# EAGLE design 02_SETAB (EAGLE 7.5.0)
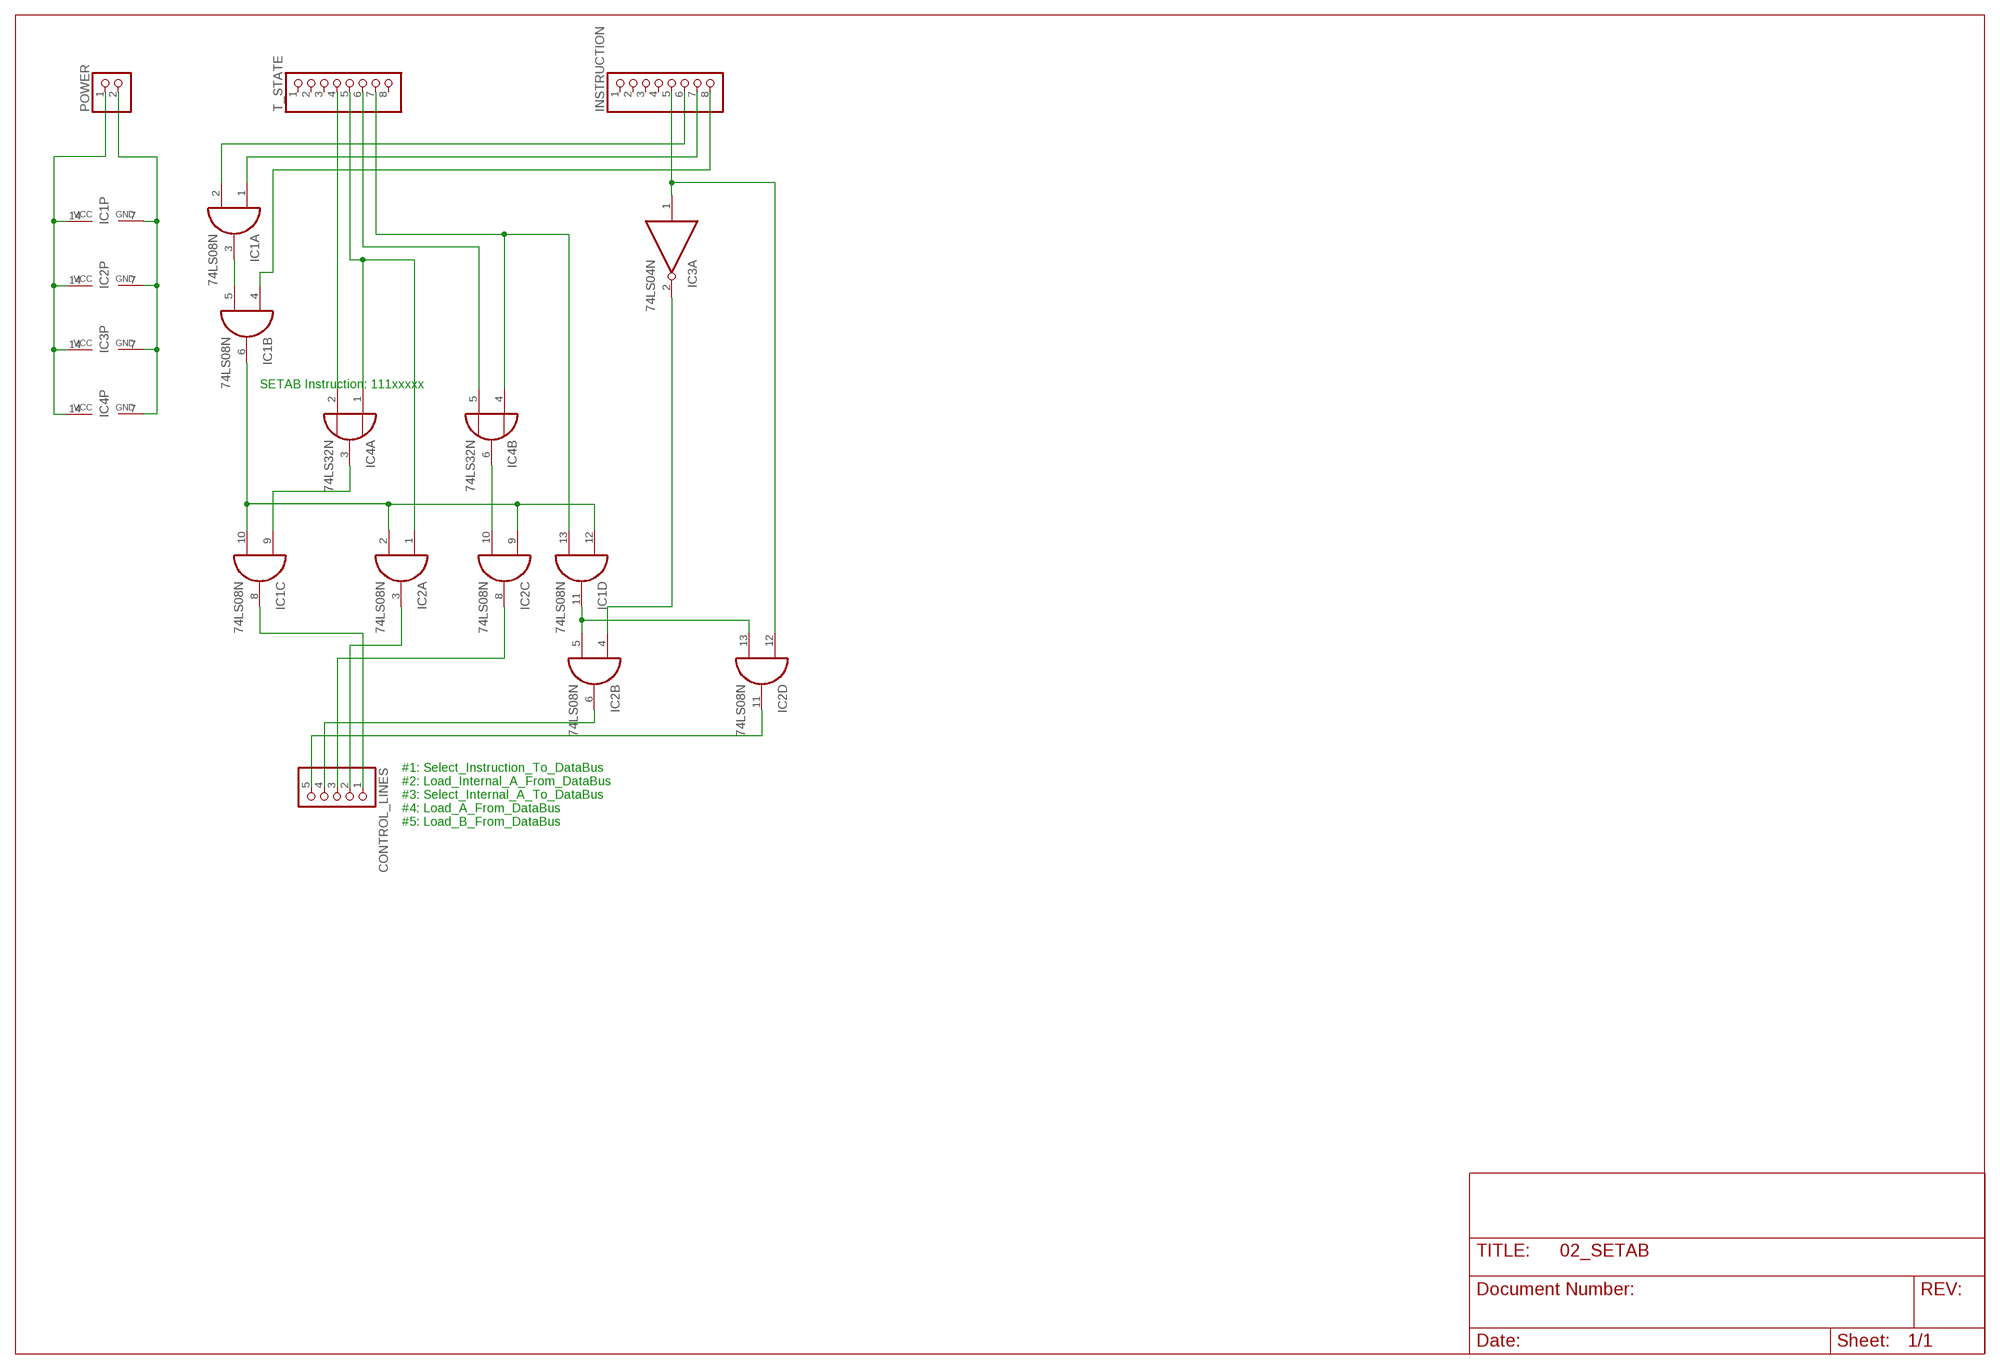
[diagram p0: schematic, sheet 1]

## Parts
CONTROL_LINES  PINHD-1X5  [1X05]
IC1  74LS08N  [DIL14]
IC2  74LS08N  [DIL14]
IC3  74LS04N  [DIL14]
IC4  74LS32N  [DIL14]
INSTRUCTION  PINHD-1X8  [1X08]
POWER  PINHD-1X2  [1X02]
T_STATE  PINHD-1X8  [1X08]

## Nets
GND: IC1.7(P:GND) IC2.7(P:GND) IC3.7(P:GND) IC4.7(P:GND) POWER.2
N$1: IC1.2(A:I1) INSTRUCTION.6
N$2: IC1.1(A:I0) INSTRUCTION.7
N$3: IC1.3(A:O) IC1.5(B:I1)
N$4: IC1.4(B:I0) INSTRUCTION.8
N$5: IC2.1(A:I0) IC4.1(A:I0) T_STATE.5
N$6: IC4.2(A:I1) T_STATE.4
N$7: CONTROL_LINES.1 IC1.8(C:O)
N$8: IC1.6(B:O) IC1.10(C:I1) IC1.12(D:I0) IC2.2(A:I1) IC2.9(C:I0)
N$9: IC1.9(C:I0) IC4.3(A:O)
N$10: CONTROL_LINES.4 IC2.6(B:O)
N$11: IC2.12(D:I0) IC3.1(A:I) INSTRUCTION.5
N$12: IC2.4(B:I0) IC3.2(A:O)
N$13: CONTROL_LINES.2 IC2.3(A:O)
N$14: IC4.5(B:I1) T_STATE.6
N$15: IC1.13(D:I1) IC4.4(B:I0) T_STATE.7
N$16: IC2.10(C:I1) IC4.6(B:O)
N$17: CONTROL_LINES.3 IC2.8(C:O)
N$18: IC1.11(D:O) IC2.5(B:I1) IC2.13(D:I1)
N$20: CONTROL_LINES.5 IC2.11(D:O)
VCC: IC1.14(P:VCC) IC2.14(P:VCC) IC3.14(P:VCC) IC4.14(P:VCC) POWER.1
Unconnected: IC3.3(B:I) IC3.4(B:O) IC3.5(C:I) IC3.6(C:O) IC3.8(D:O) IC3.9(D:I) IC3.10(E:O) IC3.11(E:I) IC3.12(F:O) IC3.13(F:I) IC4.8(C:O) IC4.9(C:I0) IC4.10(C:I1) IC4.11(D:O) IC4.12(D:I0) IC4.13(D:I1) INSTRUCTION.1 INSTRUCTION.2 INSTRUCTION.3 INSTRUCTION.4 T_STATE.1 T_STATE.2 T_STATE.3 T_STATE.8

## Notes on the sheet
- SETAB Instruction: 111xxxxx
- #1: Select_Instruction_To_DataBus
  #2: Load_Internal_A_From_DataBus
  #3: Select_Internal_A_To_DataBus
  #4: Load_A_From_DataBus
  #5: Load_B_From_DataBus

## Library data of the parts
CONTROL_LINES = pinhead:PINHD-1X5: PIN HEADER
IC1 IC2 = 74xx-eu:74*08: Quad 2-input AND gate
IC3 = 74xx-eu:74*04: Hex INVERTER
IC4 = 74xx-eu:74*32: Quad 2-input OR gate
INSTRUCTION T_STATE = pinhead:PINHD-1X8: PIN HEADER
POWER = pinhead:PINHD-1X2: PIN HEADER

## Board
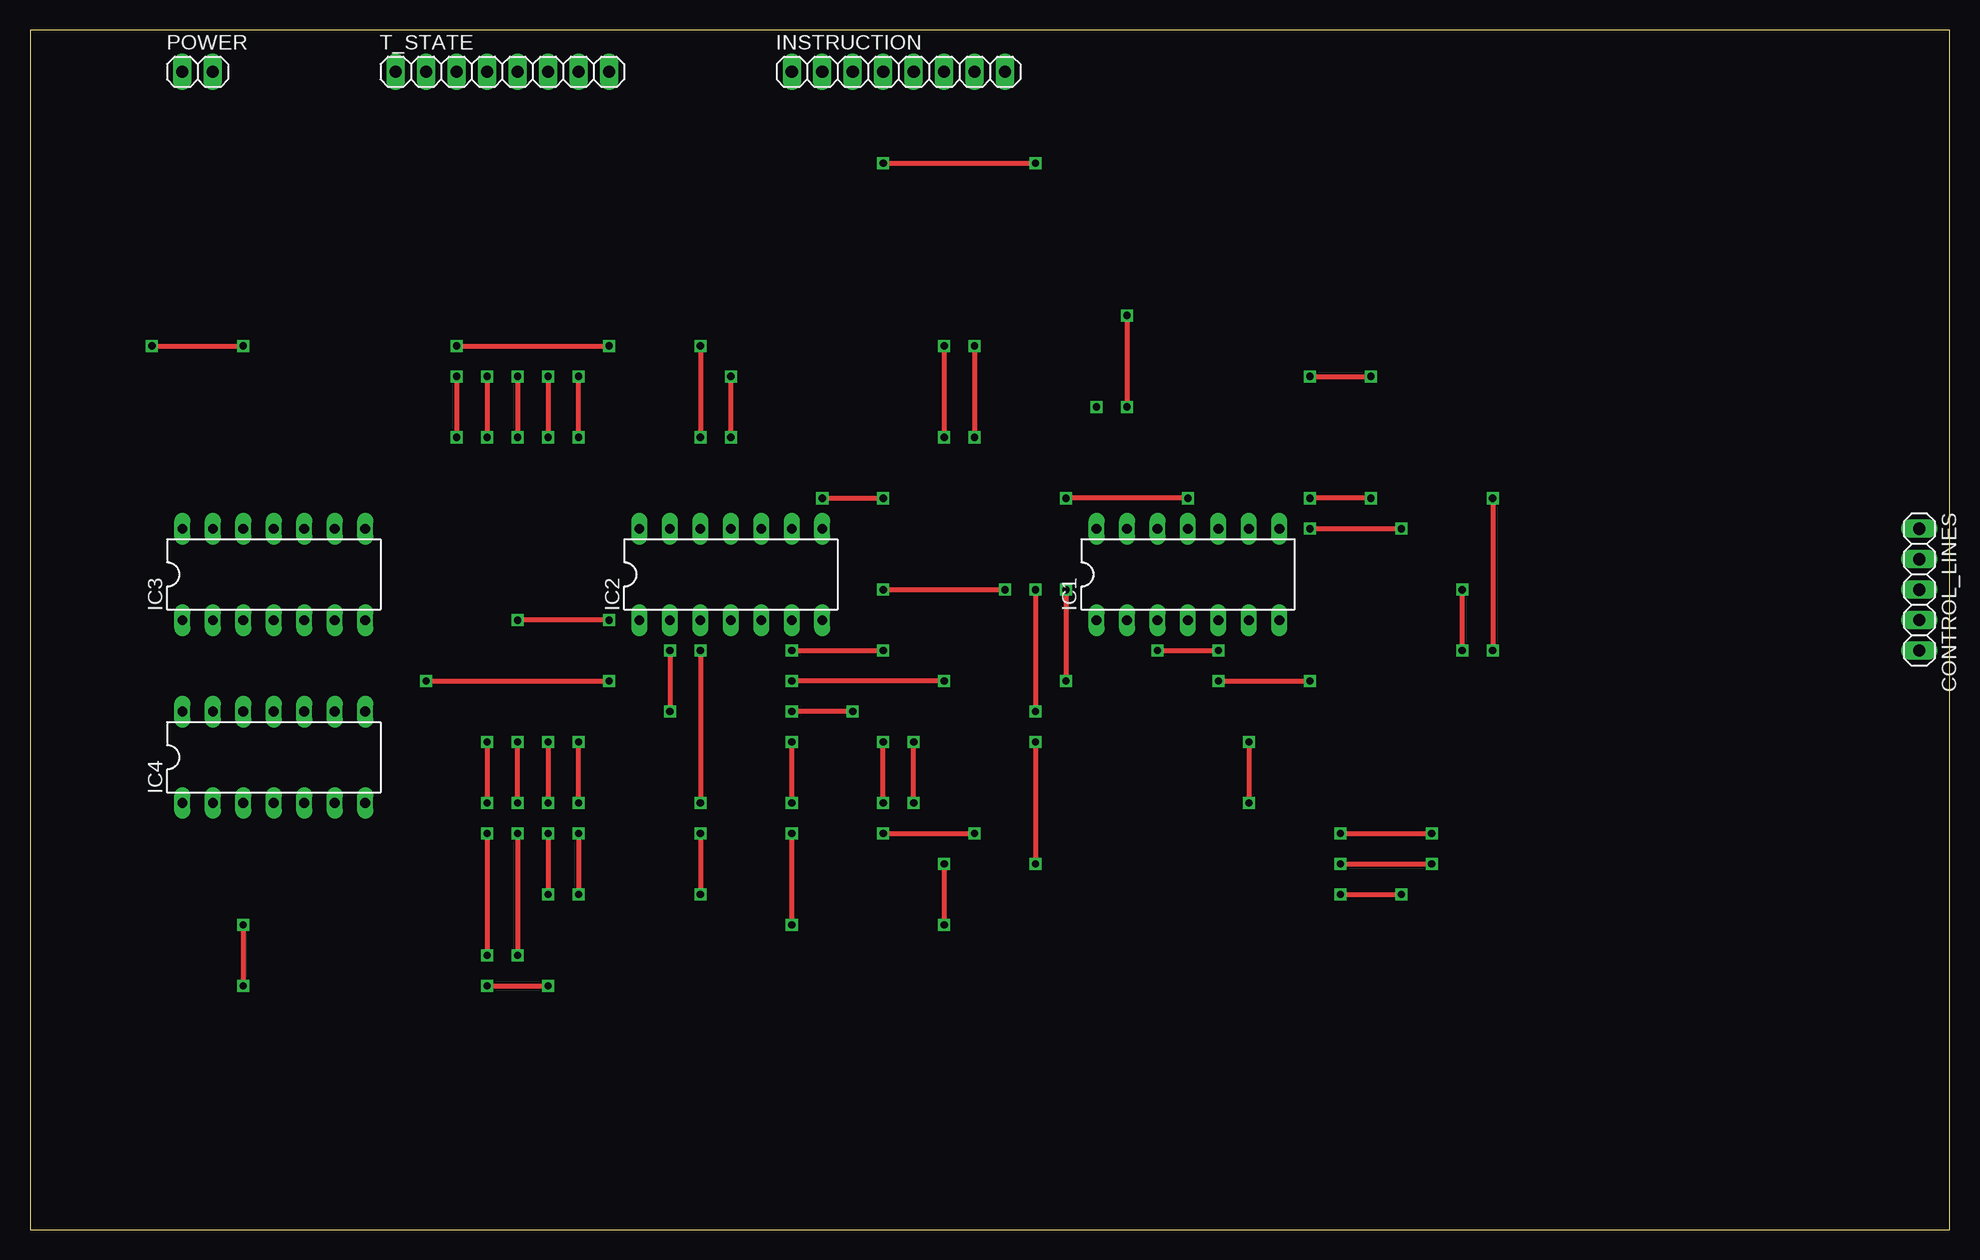
[diagram p1: board, top side]
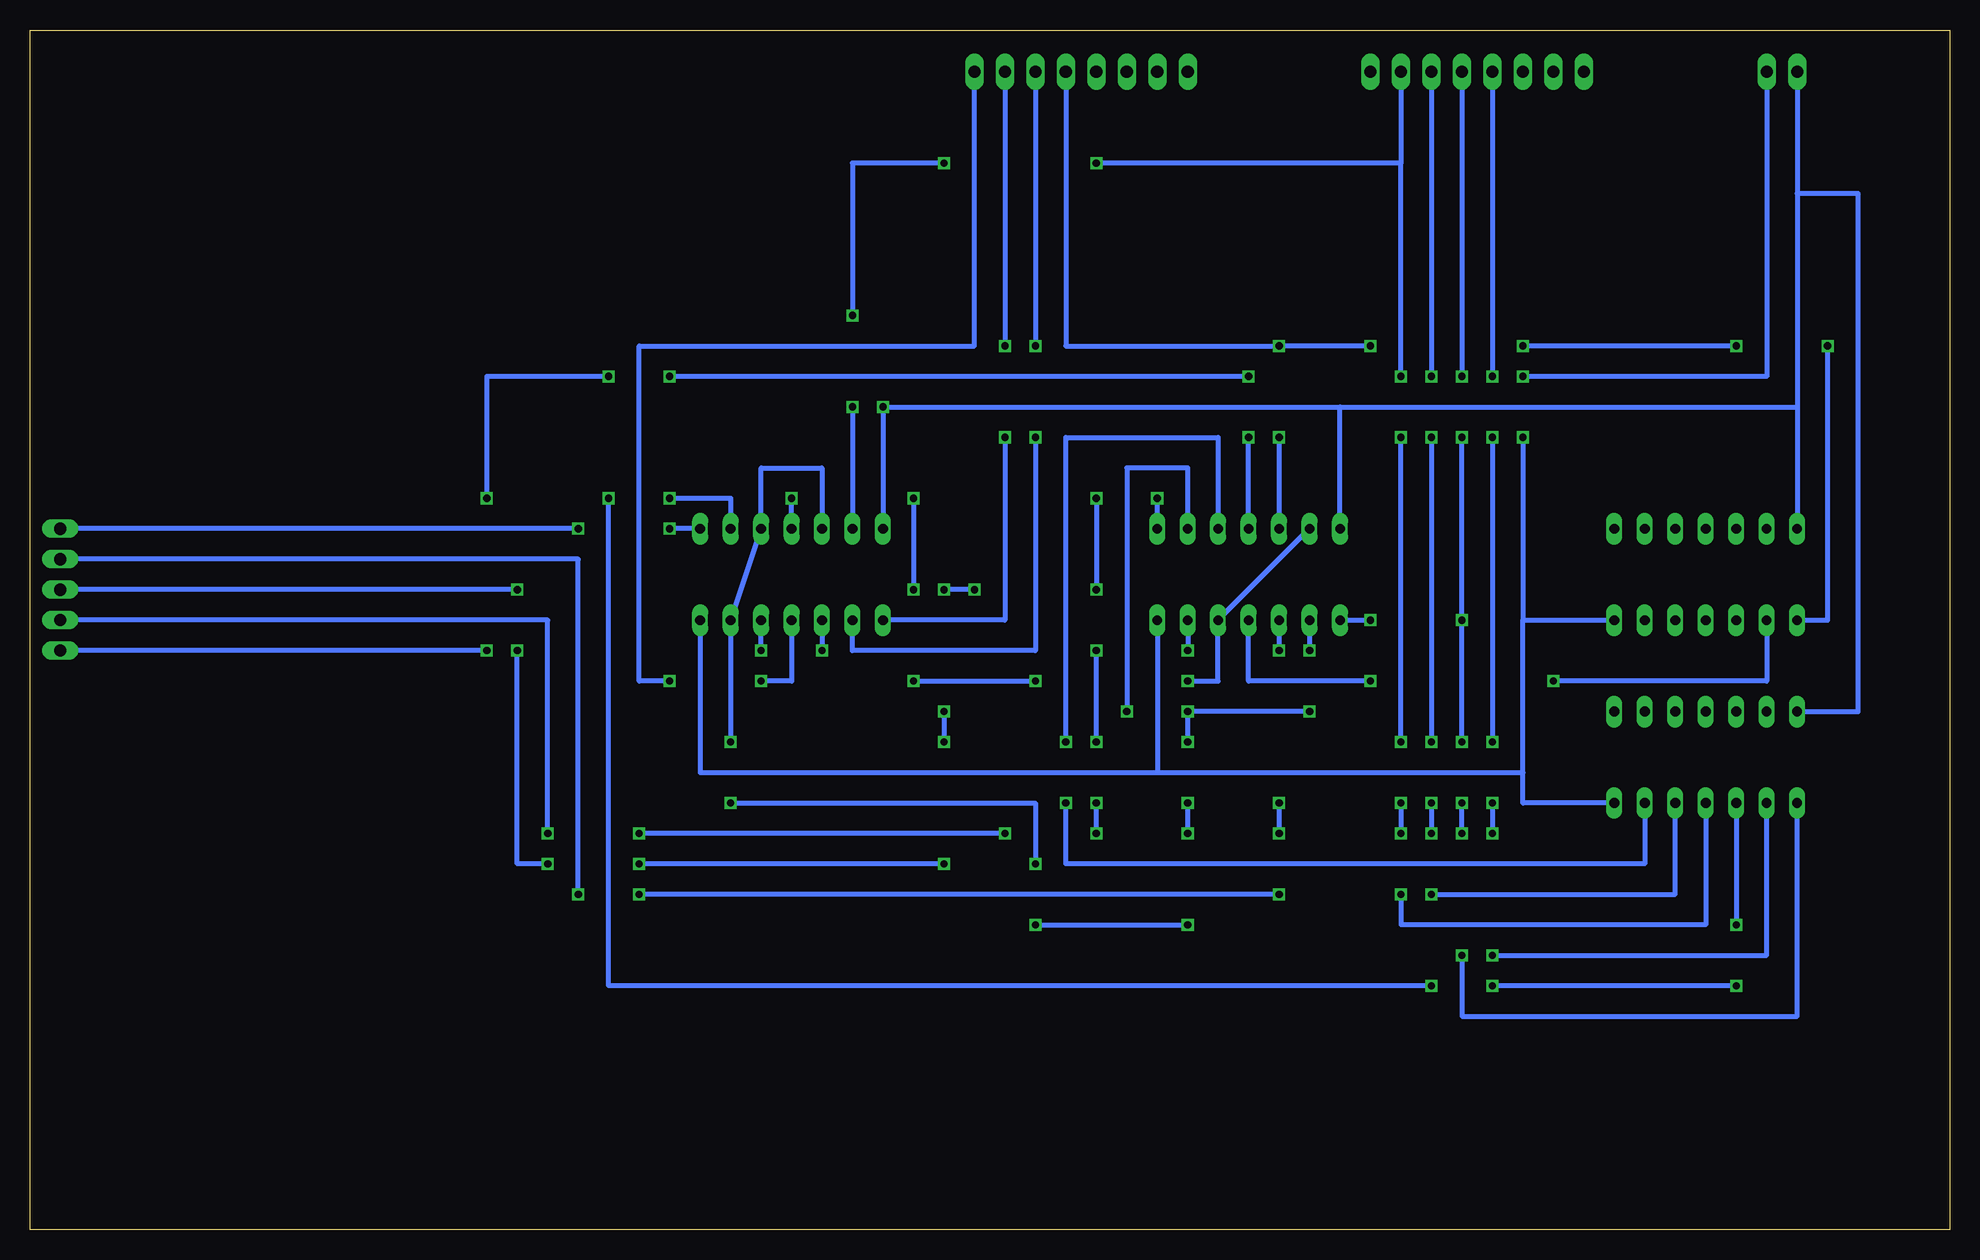
[diagram p2: board, bottom side, seen from below]

Size 160 x 100 mm. Coordinates in mm from the lower left corner, seen from the top.
Outline: 0,0 160,0 160,100 0,100 0,0
Copper layers (1*16): Top 0.035mm / dielectric 1.5mm / Bottom 0.035mm
Design rules "default": minimum track width 10mil, minimum drill 24mil, track to track 8mil, track to pad 8mil, pad to pad 8mil, via to via 8mil, smd to smd 8mil, copper to edge 40mil, drill to drill 8mil, minimum pad ring 10mil, minimum via ring 8mil, stop-mask expansion 4mil, vias tented up to drill 0mil, thermal gap 10mil

### Footprints (pad centres in the part's own frame; a part is rotated, then mirrored left to right if it is on the bottom)
1X05 = drill 1.016 long: 1 -5.08,0; 2 -2.54,0; 3 0,0; 4 2.54,0; 5 5.08,0
DIL14 = drill 0.813 long: 1 -7.62,-3.81; 2 -5.08,-3.81; 3 -2.54,-3.81; 4 0,-3.81; 5 2.54,-3.81; 6 5.08,-3.81; 7 7.62,-3.81; 8 7.62,3.81; 9 5.08,3.81; 10 2.54,3.81; 11 0,3.81; 12 -2.54,3.81; 13 -5.08,3.81; 14 -7.62,3.81
1X08 = drill 1.016 long: 1 -8.89,0; 2 -6.35,0; 3 -3.81,0; 4 -1.27,0; 5 1.27,0; 6 3.81,0; 7 6.35,0; 8 8.89,0
1X02 = drill 1.016 long: 1 -1.27,0; 2 1.27,0

### Placement (x,y rotation side)
CONTROL_LINES  157.48,53.34 270 top
IC1  96.52,54.61 0 top
IC2  58.42,54.61 0 top
IC3  20.32,54.61 0 top
IC4  20.32,39.37 0 top
INSTRUCTION  72.39,96.52 0 top
POWER  13.97,96.52 0 top
T_STATE  39.37,96.52 0 top

### Tracks (layer width: path | path; a pad name or v marks a point on that pad's centre or on a via)
GND  (via drill 0.6)
  Top 0.406: v35.56,71.12 v35.56,66.04
  Bottom 0.406: POWER.2 15.24,71.12 v35.56,71.12 | v35.56,66.04 35.56,50.8 | 35.56,50.8 IC3.7 | IC2.7 66.04,38.1 | 66.04,38.1 35.56,38.1 | 35.56,38.1 35.56,50.8 | IC1.7 104.14,38.1 66.04,38.1 | IC4.7 35.56,35.56 35.56,38.1
N$1  (via drill 0.6)
  Top 0.406: v76.2,73.66 v76.2,66.04
  Bottom 0.406: INSTRUCTION.6 v76.2,73.66 | v76.2,66.04 76.2,48.26 91.44,48.26 IC1.2
N$2  (via drill 0.6)
  Top 0.406: v78.74,73.66 v78.74,66.04
  Bottom 0.406: INSTRUCTION.7 v78.74,73.66 | v78.74,66.04 78.74,50.8 IC1.1
N$3  (via drill 0.6)
  Top 0.406: v93.98,48.26 v99.06,48.26
  Bottom 0.406: IC1.3 v93.98,48.26 | v99.06,48.26 IC1.5
N$4  (via drill 0.6)
  Top 0.406: v99.06,45.72 v106.68,45.72
  Bottom 0.406: IC1.4 96.52,45.72 v99.06,45.72 | v106.68,45.72 109.22,45.72 109.22,73.66 81.28,73.66 INSTRUCTION.8
N$5  (via drill 0.6)
  Top 0.406: v40.64,71.12 v40.64,66.04 | v40.64,33.02 v40.64,22.86 | v40.64,35.56 v40.64,40.64 | v48.26,50.8 v40.64,50.8
  Bottom 0.406: T_STATE.5 v40.64,71.12 | v40.64,22.86 40.64,17.78 12.7,17.78 IC4.1 | v40.64,33.02 v40.64,35.56 | v40.64,40.64 v40.64,50.8 v40.64,66.04 | IC2.1 v48.26,50.8
N$6  (via drill 0.6)
  Top 0.406: v38.1,71.12 v38.1,66.04 | v38.1,40.64 v38.1,35.56 | v38.1,33.02 v38.1,22.86
  Bottom 0.406: T_STATE.4 v38.1,71.12 | v38.1,66.04 v38.1,40.64 | v38.1,35.56 v38.1,33.02 | v38.1,22.86 15.24,22.86 IC4.2
N$7  (via drill 0.6)
  Top 0.406: v106.68,58.42 v114.3,58.42
  Bottom 0.406: IC1.8 v106.68,58.42 | v114.3,58.42 CONTROL_LINES.1
N$8  (via drill 0.6)
  Top 0.406: v53.34,48.26 v53.34,43.18 | v101.6,40.64 v101.6,35.56 | v76.2,30.48 v76.2,25.4 | v63.5,25.4 v63.5,33.02 | v63.5,35.56 v63.5,40.64 | v68.58,43.18 v63.5,43.18
  Bottom 0.406: IC2.2 v53.34,48.26 | v53.34,43.18 v63.5,43.18 v63.5,40.64 | IC1.12 93.98,63.5 99.06,63.5 IC1.10 IC1.6 v101.6,40.64 | v101.6,35.56 76.2,35.56 v76.2,30.48 | v76.2,25.4 v63.5,25.4 | v63.5,33.02 v63.5,35.56 | IC2.9 63.5,63.5 68.58,63.5 v68.58,43.18
N$9  (via drill 0.6)
  Top 0.406: v17.78,25.4 v17.78,20.32 | v38.1,20.32 v43.18,20.32 | v111.76,60.96 v106.68,60.96
  Bottom 0.406: IC4.3 v17.78,25.4 | v17.78,20.32 v38.1,20.32 | v43.18,20.32 111.76,20.32 v111.76,60.96 | v106.68,60.96 101.6,60.96 IC1.9
N$10  (via drill 0.6)
  Top 0.406: v63.5,48.26 v71.12,48.26 | v71.12,33.02 v78.74,33.02 | v109.22,33.02 v116.84,33.02 | v71.12,35.56 v71.12,40.64
  Bottom 0.406: IC2.6 v63.5,48.26 | v78.74,33.02 v109.22,33.02 | v116.84,33.02 116.84,50.8 CONTROL_LINES.4 | v71.12,33.02 v71.12,35.56 | v71.12,40.64 v71.12,48.26
N$11  (via drill 0.6)
  Top 0.406: v55.88,73.66 v55.88,66.04 | v10.16,73.66 v17.78,73.66 | v35.56,73.66 v48.26,73.66
  Bottom 0.406: INSTRUCTION.5 73.66,73.66 v55.88,73.66 v48.26,73.66 | IC3.1 10.16,50.8 v10.16,73.66 | v17.78,73.66 v35.56,73.66 | v55.88,66.04 IC2.12
N$12  (via drill 0.6)
  Top 0.406: v33.02,45.72 v48.26,45.72
  Bottom 0.406: IC3.2 15.24,45.72 v33.02,45.72 | v48.26,45.72 58.42,45.72 IC2.4
N$13  (via drill 0.6)
  Top 0.406: v55.88,48.26 v55.88,35.56 | v55.88,33.02 v55.88,27.94 | v109.22,27.94 v114.3,27.94
  Bottom 0.406: IC2.3 v55.88,48.26 | v55.88,35.56 v55.88,33.02 | v55.88,27.94 v109.22,27.94 | v114.3,27.94 114.3,55.88 CONTROL_LINES.2
N$14  (via drill 0.6)
  Top 0.406: v43.18,71.12 v43.18,66.04 | v43.18,40.64 v43.18,35.56 | v43.18,33.02 v43.18,27.94
  Bottom 0.406: T_STATE.6 v43.18,71.12 | v43.18,66.04 v43.18,40.64 | v43.18,27.94 22.86,27.94 IC4.5 | v43.18,35.56 v43.18,33.02
N$15  (via drill 0.6)
  Top 0.406: v71.12,88.9 v83.82,88.9 | v91.44,76.2 v91.44,68.58 | v45.72,35.56 v45.72,40.64 | v45.72,66.04 v45.72,71.12 | v45.72,33.02 v45.72,27.94
  Bottom 0.406: T_STATE.7 45.72,88.9 | 45.72,88.9 v71.12,88.9 | v83.82,88.9 91.44,88.9 v91.44,76.2 | v91.44,68.58 IC1.13 | IC4.4 20.32,25.4 45.72,25.4 v45.72,27.94 | v45.72,40.64 v45.72,66.04 | v45.72,71.12 45.72,88.9 | v45.72,35.56 v45.72,33.02
N$16  (via drill 0.6)
  Top 0.406: v73.66,35.56 v73.66,40.64
  Bottom 0.406: IC2.10 60.96,66.04 73.66,66.04 v73.66,40.64 | IC4.6 25.4,30.48 73.66,30.48 v73.66,35.56
N$17  (via drill 0.6)
  Top 0.406: v66.04,60.96 v71.12,60.96 | v71.12,53.34 v81.28,53.34 | v83.82,53.34 v83.82,43.18 | v83.82,40.64 v83.82,30.48 | v109.22,30.48 v116.84,30.48 | v119.38,48.26 v119.38,53.34
  Bottom 0.406: IC2.8 v66.04,60.96 | v71.12,60.96 v71.12,53.34 | v81.28,53.34 v83.82,53.34 | v83.82,43.18 v83.82,40.64 | v83.82,30.48 v109.22,30.48 | v116.84,30.48 119.38,30.48 v119.38,48.26 | v119.38,53.34 CONTROL_LINES.3
N$18  (via drill 0.6)
  Top 0.406: v96.52,60.96 v86.36,60.96 | v86.36,53.34 v86.36,45.72 | v76.2,45.72 v63.5,45.72
  Bottom 0.406: IC1.11 v96.52,60.96 | v86.36,60.96 v86.36,53.34 | v86.36,45.72 v76.2,45.72 | v63.5,45.72 60.96,45.72 IC2.5 IC2.13
N$20  (via drill 0.6)
  Top 0.406: v58.42,66.04 v58.42,71.12 | v106.68,71.12 v111.76,71.12 | v121.92,60.96 v121.92,48.26
  Bottom 0.406: IC2.11 v58.42,66.04 | v58.42,71.12 v106.68,71.12 | v111.76,71.12 121.92,71.12 v121.92,60.96 | v121.92,48.26 CONTROL_LINES.5
VCC  (via drill 0.6)
  Bottom 0.406: POWER.1 12.7,86.36 | 12.7,86.36 12.7,68.58 | 12.7,68.58 IC3.14 | IC2.14 50.8,68.58 | 50.8,68.58 12.7,68.58 | 50.8,68.58 v88.9,68.58 IC1.14 | IC4.14 7.62,43.18 7.62,86.36 12.7,86.36